# EAGLE design RJ-11 Jack Breakout (EAGLE 7.3.0)
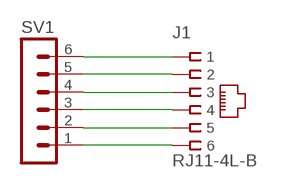
[diagram p0: schematic, sheet 1]

## Parts
J1  RJ11-4L-B  [RJ11-NO_SHIELD]
SV1  MA06-1  [MA06-1]

## Nets
N$1: J1.1 SV1.6
N$2: J1.2 SV1.5
N$3: J1.3 SV1.4
N$4: J1.4 SV1.3
N$5: J1.5 SV1.2
N$6: J1.6 SV1.1

## Library data of the parts
J1 = con-tycoelectronics:RJ11: CORCOM Modular RJ Jacks No Shield Source: www.tycoelectronics.com .. ENG_DS_1654001_1099_RJ_L_0507.pdf; MF: TYCO ELECTRONICS; MPN: RJ11-4L-B; OC_FARNELL: unknown; OC_NEWARK: 52K3315
SV1 = con-lstb:MA06-1: PIN HEADER; OC_FARNELL: unknown; OC_NEWARK: unknown

## Net classes
0 default: width 0.279 mm, drill 0.279 mm, clearance 0.279 mm

## Board
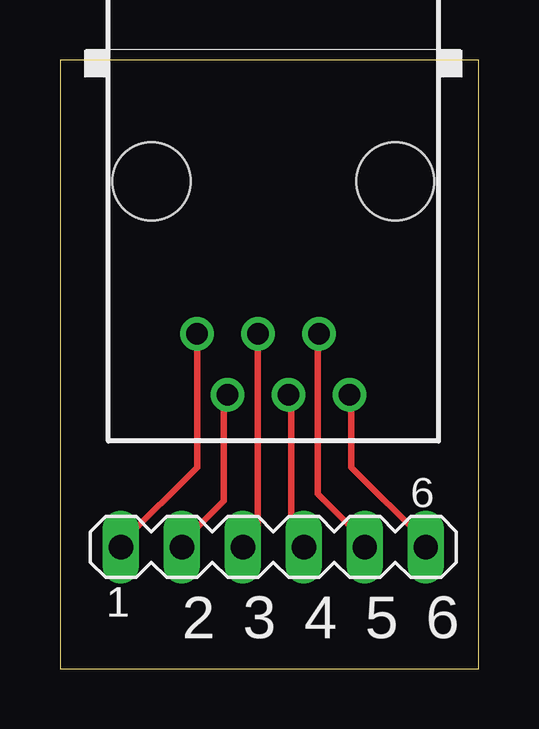
[diagram p1: board, top side]

Size 17.45 x 25.39 mm. Coordinates in mm from the lower left corner, seen from the top.
Outline: 0,0 17.45,0 17.45,25.39 0,25.39 0,0
Copper layers (1*16): Top 0.0356mm / dielectric 1.5011mm / Bottom 0.0356mm
Design rules "PCBs_io": minimum track width 6mil, minimum drill 13mil, track to track 6mil, track to pad 6mil, pad to pad 6mil, via to via 6mil, smd to smd 6mil, copper to edge 15mil, drill to drill 6mil, minimum pad ring 7mil, minimum via ring 7mil, stop-mask expansion 3mil, vias tented up to drill 0mil, thermal gap 10mil

### Footprints (pad centres in the part's own frame; a part is rotated, then mirrored left to right if it is on the bottom)
RJ11-NO_SHIELD = drill 0.9 pad 1.4: 1 -3.175,8.89; 2 -1.905,6.35; 3 -0.635,8.89; 4 0.635,6.35; 5 1.905,8.89; 6 3.175,6.35 | hole 3.251: -5.08,0; 5.08,0
MA06-1 = drill 1.016 long: 1 -6.35,0; 2 -3.81,0; 3 -1.27,0; 4 1.27,0; 5 3.81,0; 6 6.35,0

### Placement (x,y rotation side)
J1  8.89,20.32 180 top
SV1  8.89,5.08 0 top

### Tracks (layer width: path | path; a pad name or v marks a point on that pad's centre or on a via)
N$1
  Top 0.279: J1.1 12.14,11.2 12.14,8.41 15.21,5.33 SV1.6
N$2
  Top 0.279: J1.2 10.74,13.72 10.74,7.29 12.7,5.33 SV1.5
N$3
  Top 0.279: SV1.4 9.63,5.61 9.63,11.2 J1.3
N$4
  Top 0.279: J1.4 8.23,13.72 8.23,5.89 7.67,5.33 SV1.3
N$5
  Top 0.279: J1.5 6.83,11.2 6.83,7.01 5.16,5.33 SV1.2
N$6
  Top 0.279: J1.6 5.71,8.41 2.64,5.33 SV1.1

### Text on the board
tNames: 2 | 3 | 4 | 5 | 6